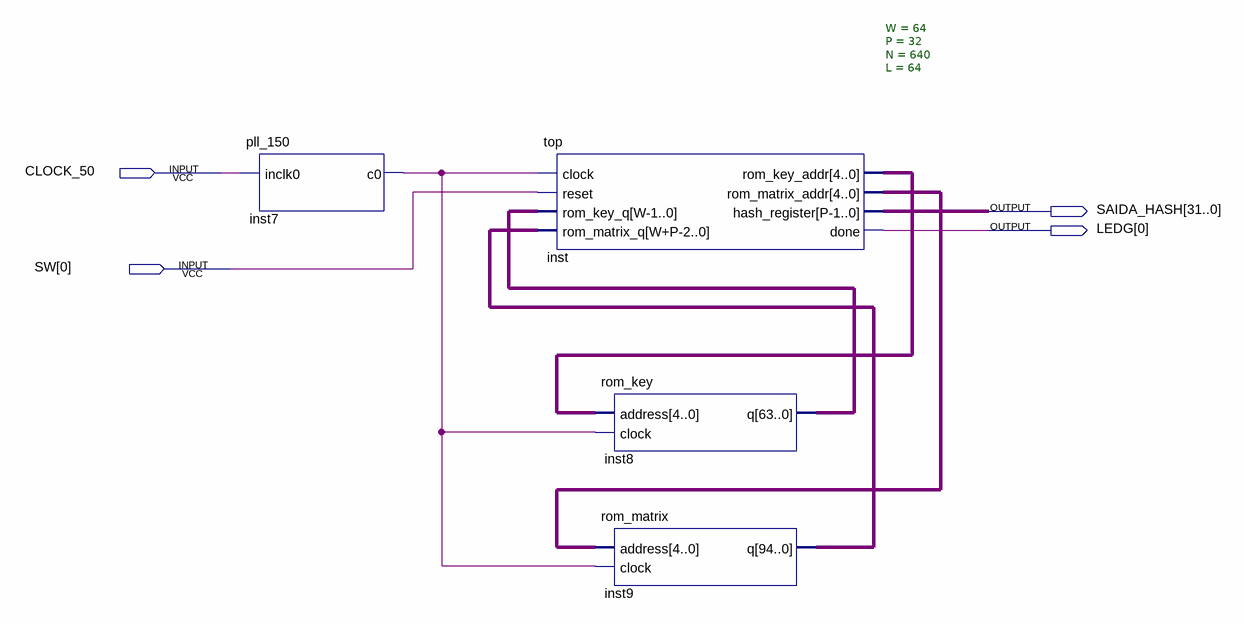
[diagram p0: schematic sheet]
// Quartus schematic sistema_completo.bdf as structural Verilog: 4 symbols, 4 pins
module sistema_completo (
  input  CLOCK_50,
  input  [0:0] SW,
  output [31:0] SAIDA_HASH,
  output [0:0] LEDG
);

  wire inst7_c0;
  wire [4:0] inst_rom_key_addr, inst_rom_matrix_addr;
  wire [63:0] inst8_q;
  wire [94:0] inst9_q;

  pll_150 inst7 (.inclk0(CLOCK_50), .c0(inst7_c0));
  top #(.W(64), .P(32), .N(640), .L(64)) inst (
    .clock(inst7_c0), .reset(SW[0]), .rom_key_q(inst8_q), .rom_matrix_q(inst9_q),
    .rom_key_addr(inst_rom_key_addr), .rom_matrix_addr(inst_rom_matrix_addr), .hash_register(SAIDA_HASH),
    .done(LEDG[0]));
  rom_key inst8 (.address(inst_rom_key_addr), .clock(inst7_c0), .q(inst8_q));
  rom_matrix inst9 (.address(inst_rom_matrix_addr), .clock(inst7_c0), .q(inst9_q));
endmodule
